# Altium schematic sheet BLDC_Driver_E1.SchDoc
size 420 x 297 mm; Address1: Address1; Address2: Address2; Address3: Address3; Address4: Address4; SheetNumber: 1; Scale: 1:1; Разраб.: Лепотенко А.С.; Обозначение документа: BLDC.421232.001 Э1; Перв. применение: BLDC.421232.001; Наименование изделия 1: Драйвер BLDC; Наименование изделия 2: Схема электрическая; Наименование изделия 3: принципиальная; Нач. отд.: Нач. отд.
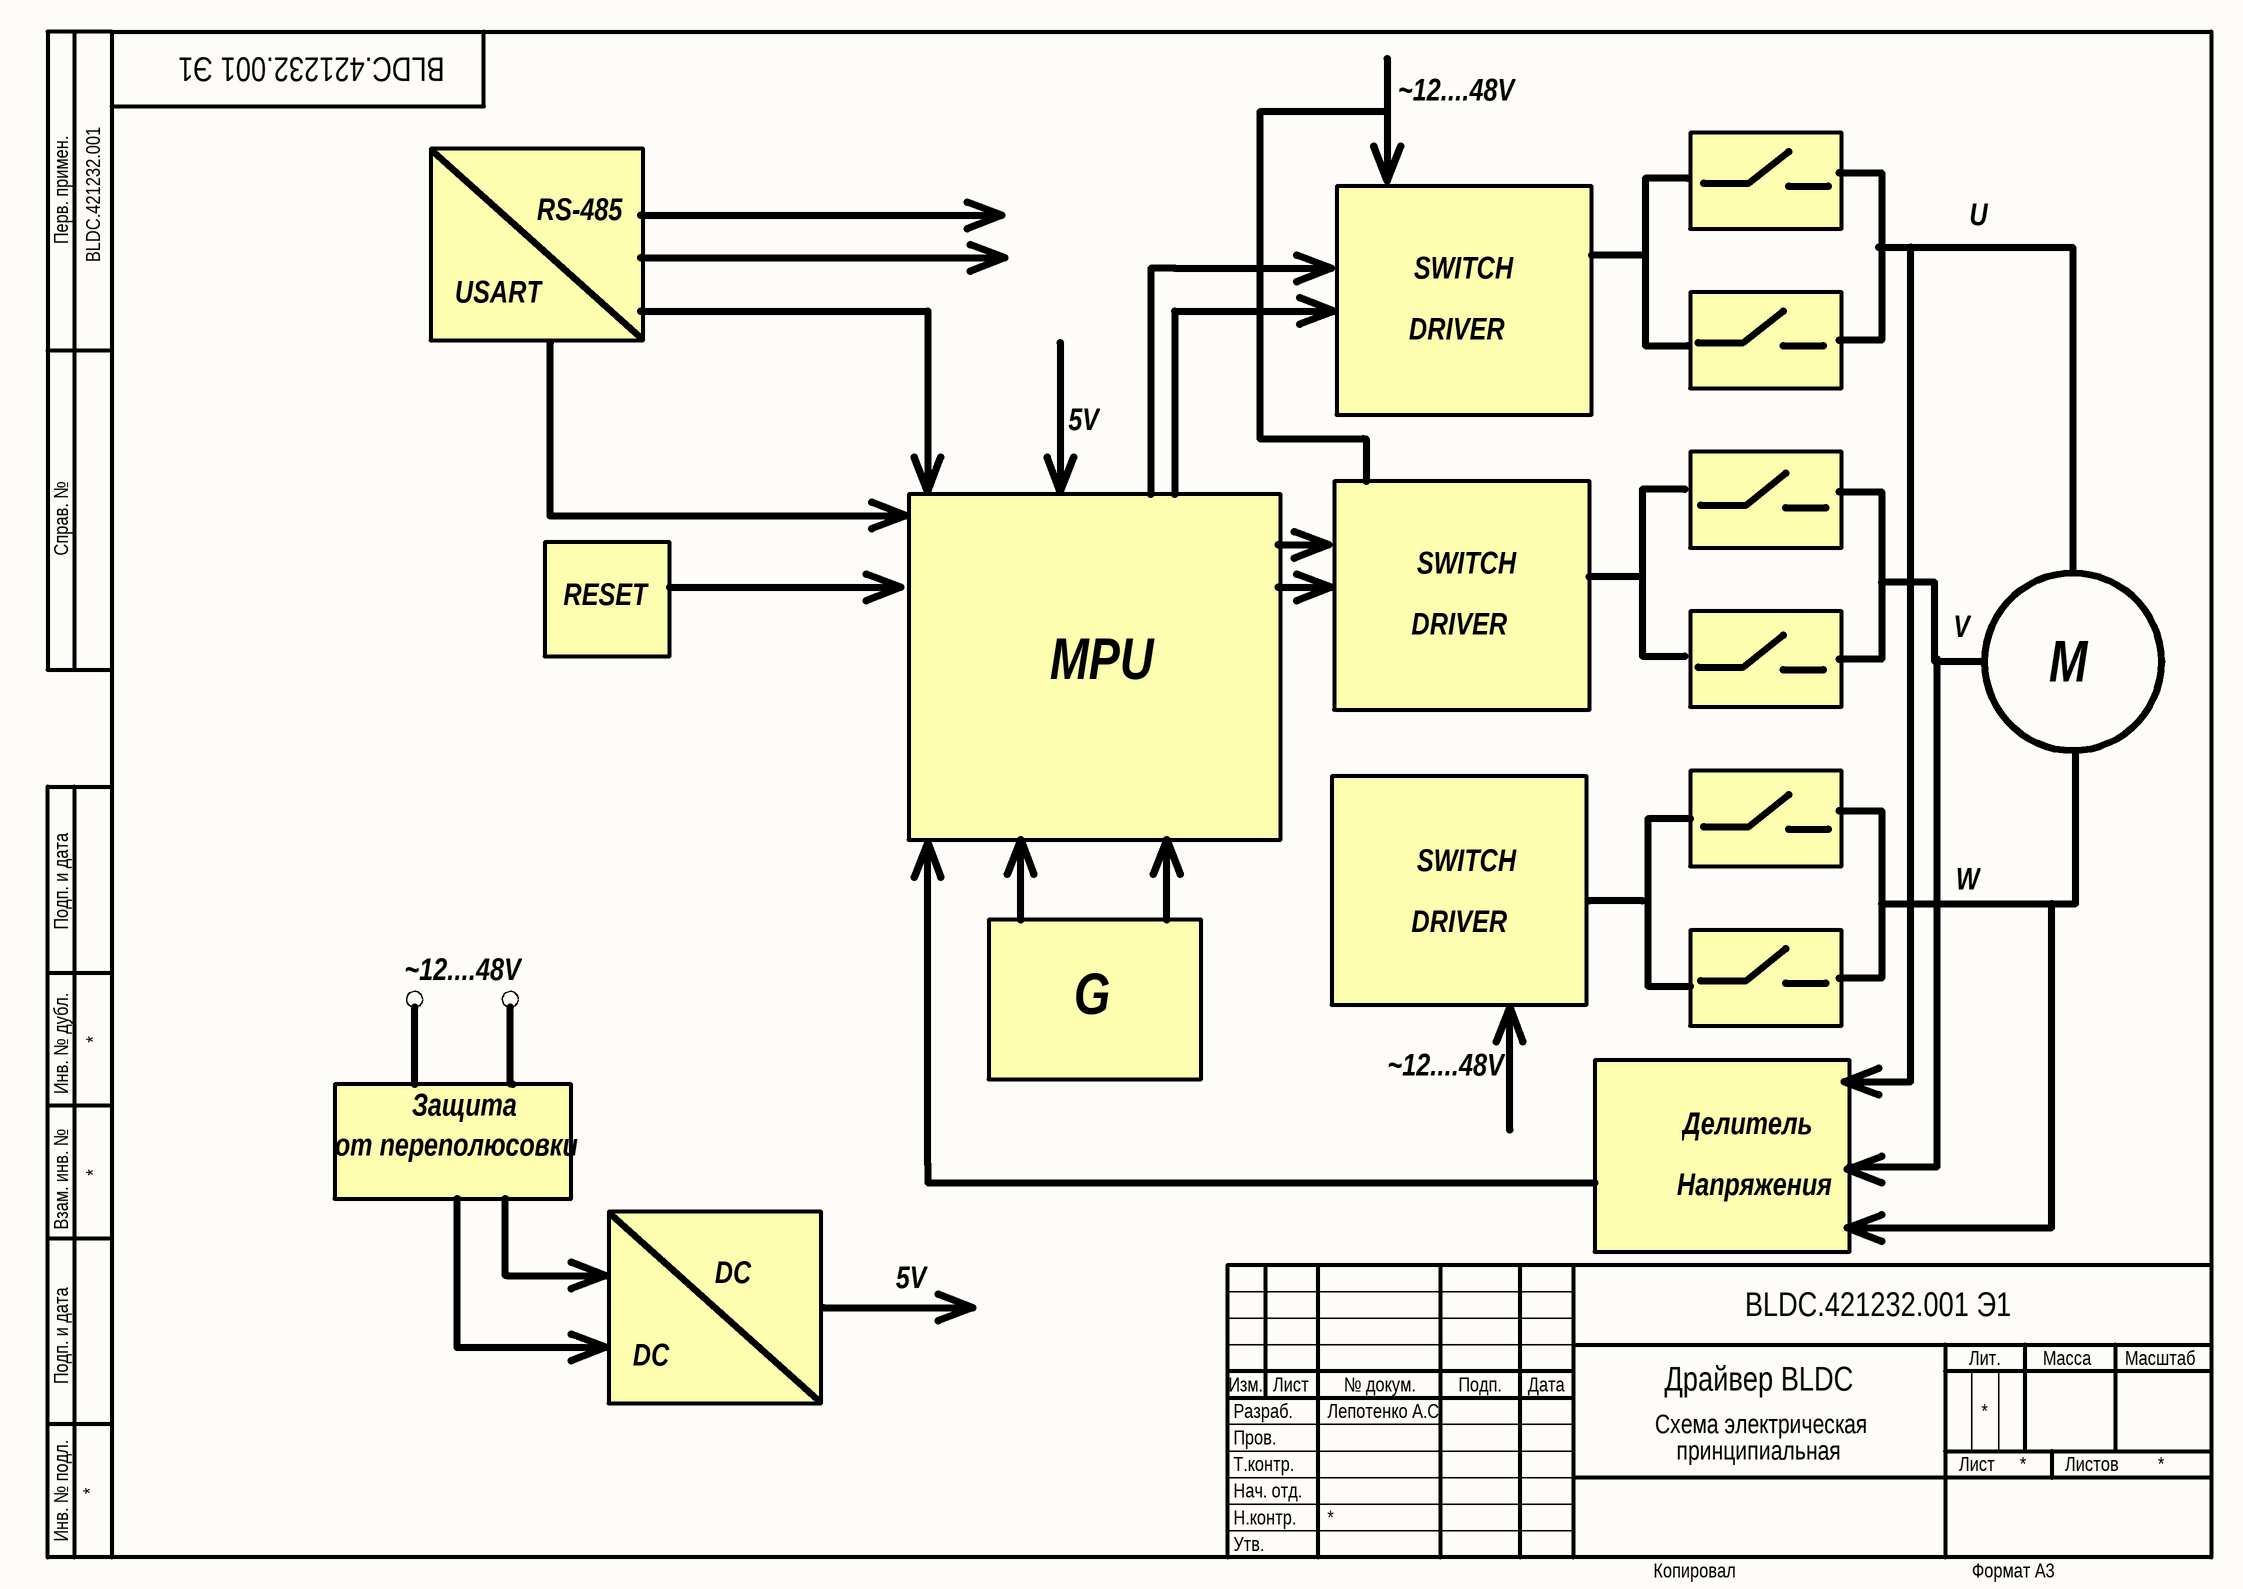
[diagram p0: BLDC_Driver_E1.SchDoc]

## Notes on the sheet
- ~12....48V
- RS-485
- U
- USART
- SWITCH
- DRIVER
- 5V
- RESET
- V
- MPU
- M
- W
- G
- Защита
- Делитель
- от переполюсовки
- Напряжения
- DC
- Перв. примен.
- Справ. №
- Подп. и дата
- Инв. № дубл.
- Взам. инв. №
- Разраб.
- Изм.
- Лист
- № докум.
- Подп.
- Дата
- Лит.
- Масса
- Масштаб
- Пров.
- Т.контр.
- Листов
- Инв. № подл.
- Утв.
- Н.контр.
- Копировал
- Формат А3